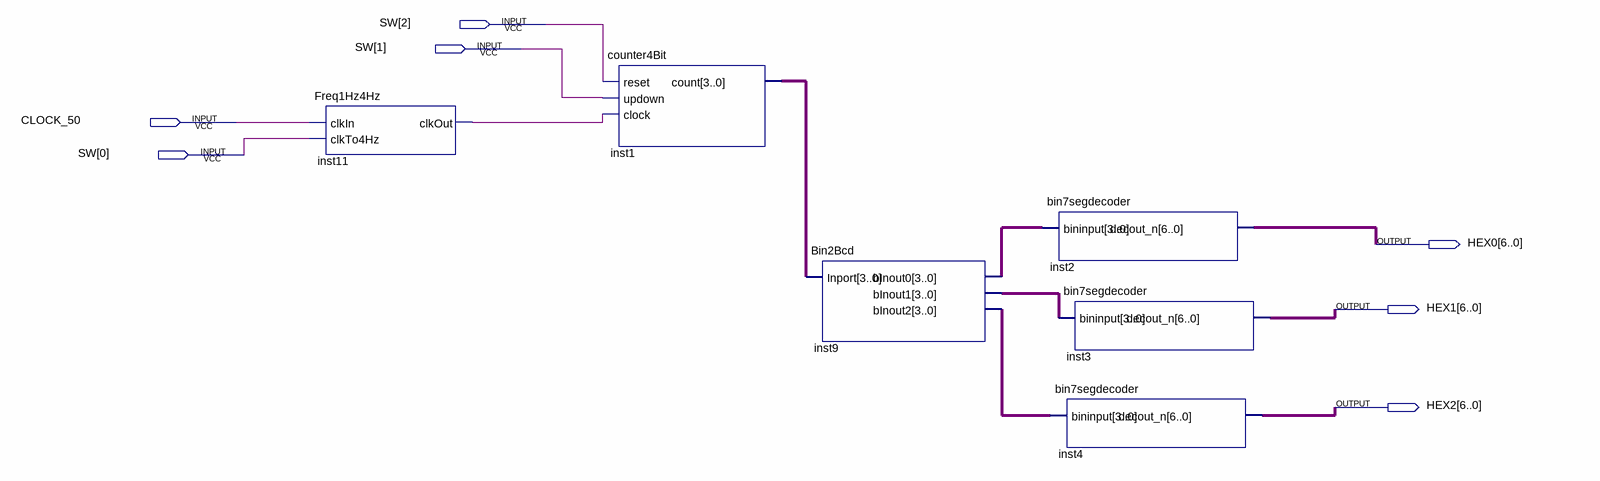
[diagram p0: schematic sheet]
// Quartus schematic mini_Demo.bdf as structural Verilog: 6 symbols, 7 pins
module mini_Demo (
  input  [2:0] SW,
  input  CLOCK_50,
  output [6:0] HEX0,
  output [6:0] HEX1,
  output [6:0] HEX2
);

  wire inst11_clkout;
  wire [3:0] inst1_count, inst9_binout0, inst9_binout1, inst9_binout2;

  Freq1Hz4Hz inst11 (.clkIn(CLOCK_50), .clkTo4Hz(SW[0]), .clkOut(inst11_clkout));
  counter4Bit inst1 (.reset(SW[2]), .updown(SW[1]), .clock(inst11_clkout), .count(inst1_count));
  Bin2Bcd inst9 (.Inport(inst1_count), .bInout0(inst9_binout0), .bInout1(inst9_binout1), .bInout2(inst9_binout2));
  bin7segdecoder inst2 (.bininput(inst9_binout0), .decout_n(HEX0));
  bin7segdecoder inst3 (.bininput(inst9_binout1), .decout_n(HEX1));
  bin7segdecoder inst4 (.bininput(inst9_binout2), .decout_n(HEX2));
endmodule
